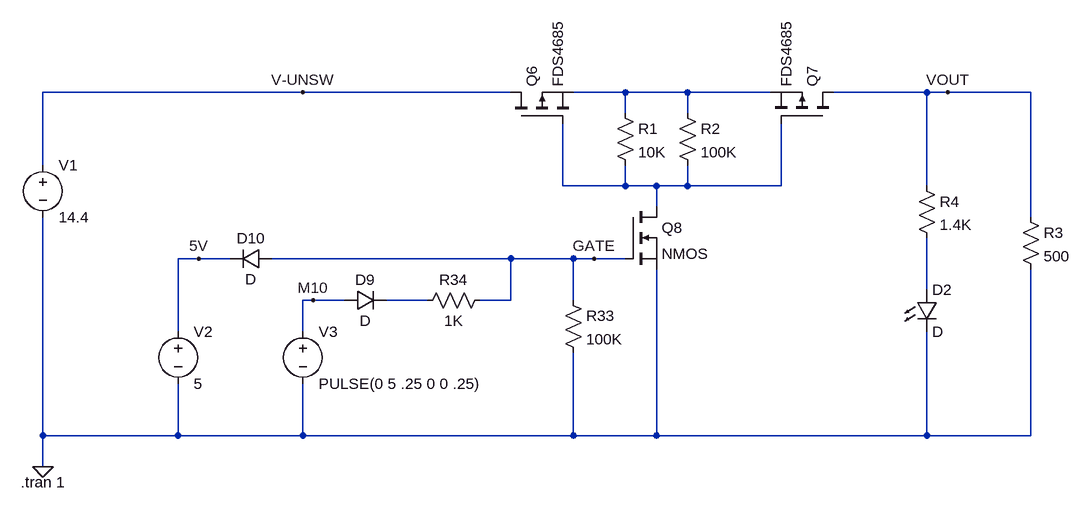
[diagram p0: schematic Draft1.asc]
Draft1.asc, the LTspice schematic file:
Version 4
SHEET 1 1376 728
WIRE -240 112 -640 112
WIRE 80 112 -240 112
WIRE 256 112 176 112
WIRE 352 112 256 112
WIRE 480 112 352 112
WIRE 720 112 576 112
WIRE 752 112 720 112
WIRE 880 112 752 112
WIRE 256 144 256 112
WIRE 352 144 352 112
WIRE -640 224 -640 112
WIRE 160 256 160 160
WIRE 256 256 256 224
WIRE 256 256 160 256
WIRE 304 256 256 256
WIRE 352 256 352 224
WIRE 352 256 304 256
WIRE 496 256 496 160
WIRE 496 256 352 256
WIRE 720 256 720 112
WIRE 304 288 304 256
WIRE 880 304 880 112
WIRE -400 368 -432 368
WIRE -352 368 -400 368
WIRE 80 368 -288 368
WIRE 176 368 80 368
WIRE 208 368 176 368
WIRE 256 368 208 368
WIRE 720 416 720 336
WIRE -224 432 -240 432
WIRE -176 432 -224 432
WIRE -48 432 -112 432
WIRE 80 432 80 368
WIRE 80 432 32 432
WIRE 176 432 176 368
WIRE -432 480 -432 368
WIRE -240 480 -240 432
WIRE -640 640 -640 304
WIRE -432 640 -432 560
WIRE -432 640 -640 640
WIRE -240 640 -240 560
WIRE -240 640 -432 640
WIRE 176 640 176 512
WIRE 176 640 -240 640
WIRE 304 640 304 384
WIRE 304 640 176 640
WIRE 720 640 720 480
WIRE 720 640 304 640
WIRE 880 640 880 384
WIRE 880 640 720 640
WIRE -640 688 -640 640
FLAG -640 688 0
FLAG 752 112 VOUT
FLAG -240 112 V-UNSW
FLAG 208 368 GATE
FLAG -400 368 5V
FLAG -224 432 M10
SYMBOL nmos 256 288 R0
SYMATTR InstName Q8
SYMBOL res 240 128 R0
SYMATTR InstName R1
SYMATTR Value 10K
SYMBOL res 336 128 R0
SYMATTR InstName R2
SYMATTR Value 100K
SYMBOL voltage -640 208 R0
WINDOW 123 0 0 Left 0
WINDOW 39 0 0 Left 0
SYMATTR InstName V1
SYMATTR Value 14.4
SYMBOL voltage -432 464 R0
SYMATTR InstName V2
SYMATTR Value 5
SYMBOL diode -288 352 R90
WINDOW 0 0 32 VBottom 2
WINDOW 3 32 32 VTop 2
SYMATTR InstName D10
SYMBOL res 160 416 R0
SYMATTR InstName R33
SYMATTR Value 100K
SYMBOL res 704 240 R0
SYMATTR InstName R4
SYMATTR Value 1.4K
SYMBOL LED 704 416 R0
SYMATTR InstName D2
SYMBOL voltage -240 464 R0
WINDOW 123 0 0 Left 0
WINDOW 39 0 0 Left 0
SYMATTR InstName V3
SYMATTR Value PULSE(0 5 .25 0 0 .25)
SYMBOL diode -176 448 R270
WINDOW 0 32 32 VTop 2
WINDOW 3 0 32 VBottom 2
SYMATTR InstName D9
SYMBOL res 48 416 R90
WINDOW 0 0 56 VBottom 2
WINDOW 3 32 56 VTop 2
SYMATTR InstName R34
SYMATTR Value 1K
SYMBOL pmos 576 160 M270
SYMATTR InstName Q7
SYMATTR Value FDS4685
SYMBOL pmos 80 160 R270
SYMATTR InstName Q6
SYMATTR Value FDS4685
SYMBOL res 864 288 R0
SYMATTR InstName R3
SYMATTR Value 500
TEXT -674 712 Left 2 !.tran 1

The netlist it stands for:
* Draft1.asc
M§Q8 N002 GATE 0 0 NMOS
R1 N001 N002 10K
R2 N001 N002 100K
V1 V-UNSW 0 14.4
V2 5V 0 5
D10 GATE 5V D
R33 GATE 0 100K
R4 VOUT N003 1.4K
D2 N003 0 D
V3 M10 0 PULSE(0 5 .25 0 0 .25)
D9 M10 N004 D
R34 GATE N004 1K
M§Q7 VOUT N002 N001 N001 FDS4685
M§Q6 V-UNSW N002 N001 N001 FDS4685
R3 VOUT 0 500
.model D D
.lib standard.dio
.model NMOS NMOS
.model PMOS PMOS
.lib standard.mos
.tran 1
.backanno
.end

* Results of the author's LTspice run, read from the files saved beside the schematic
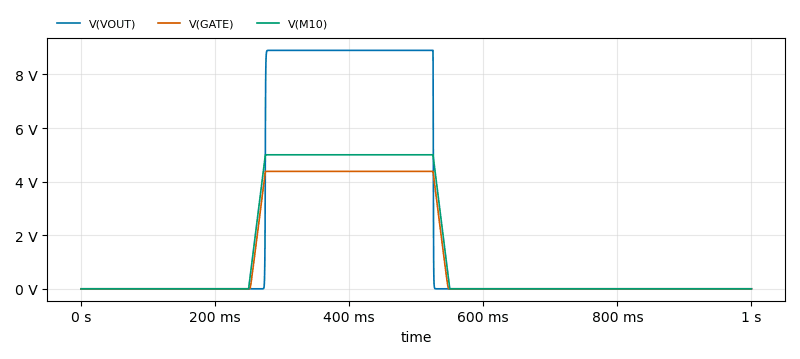
[diagram p1: Transient Analysis of Draft1.asc, plotted from the saved traces]
* Transient Analysis, 1 run:
*   V(VOUT): min -55.35 µV, max 8.897 V, average 2.231 V, rms 4.45 V, last 0 V
*   V(GATE): min 501 nV, max 4.382 V, average 1.194 V, rms 2.255 V, last 501 nV
*   V(M10): min 0 V, max 5 V, average 1.375 V, rms 2.582 V, last 0 V